# Altium schematic sheet [07] - CPU - CSI, DISP.SchDoc
size A2; DocumentNumber: 7; SheetNumber: 7; SheetTotal: 31
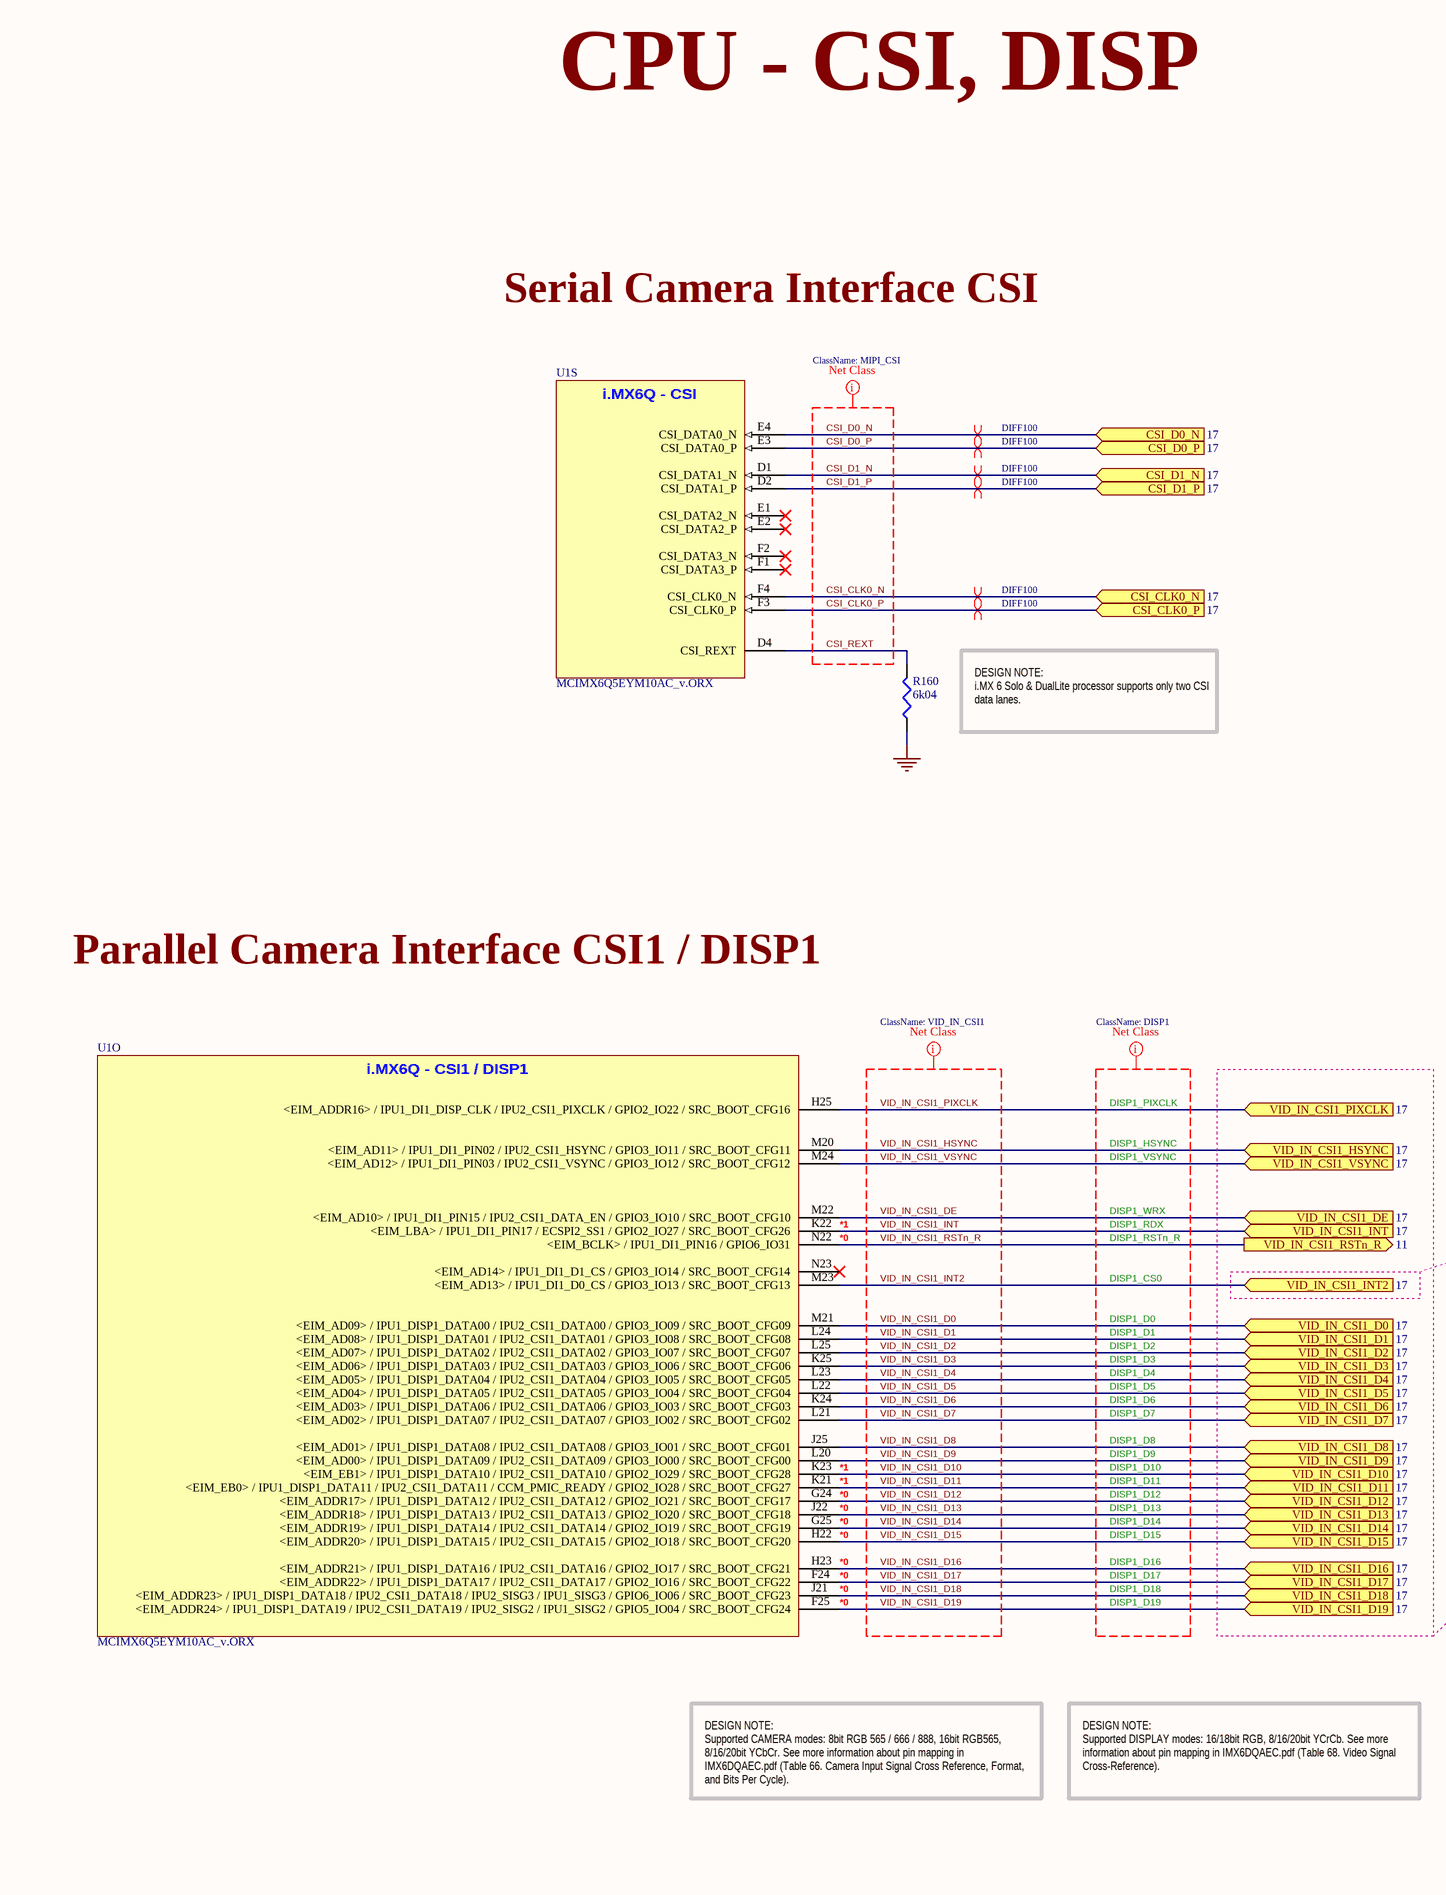
[diagram p0: [07] - CPU - CSI, DISP.SchDoc, left]
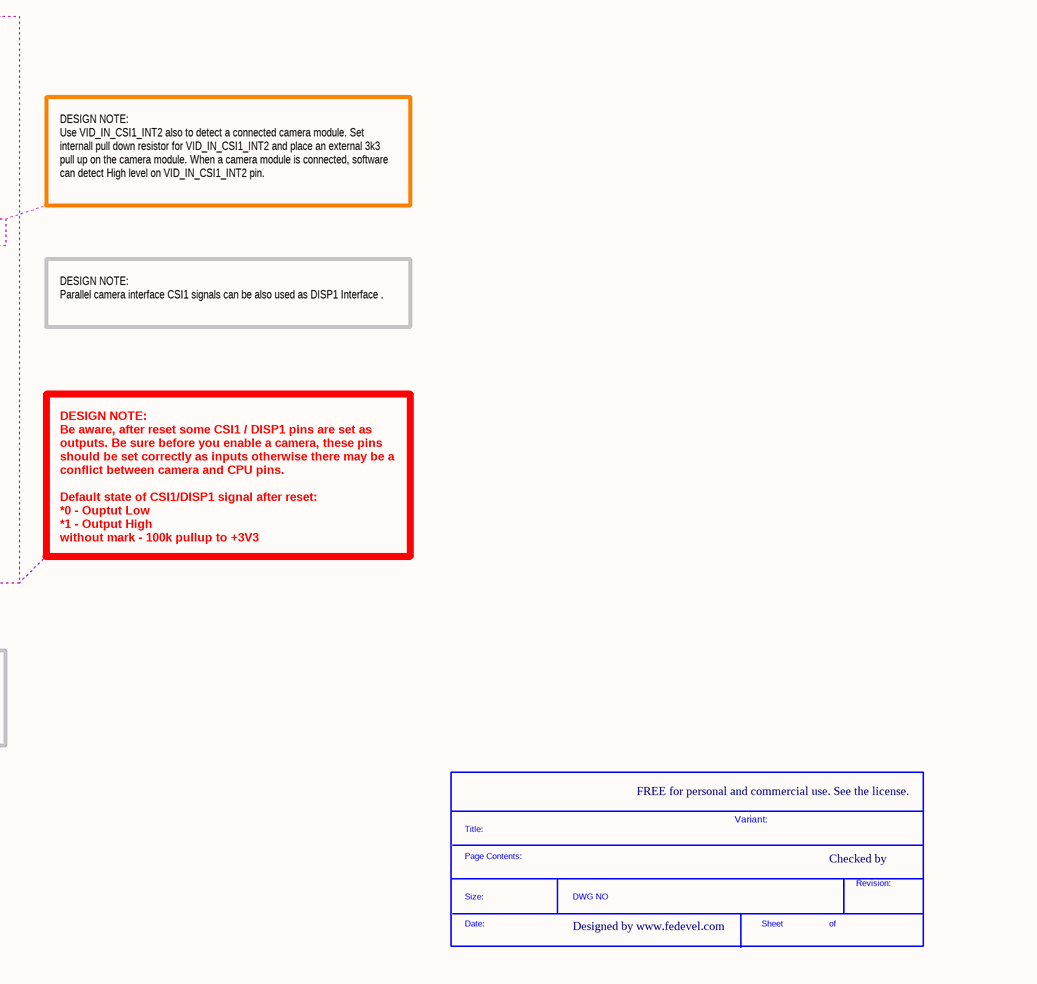
[diagram p1: [07] - CPU - CSI, DISP.SchDoc, right]

## Parts
*  SDTitleBlock  (value not drawn)  (graphical)
R160  6k04  [R0201]
U1  MCIMX6Q5EYM10AC_v.ORX  [PBGA624]  (parts O,S of 21)

## Ports
CSI_CLK0_N (in, see 17), CSI_CLK0_P (in, see 17), CSI_D0_N (in, see 17), CSI_D0_P (in, see 17), CSI_D1_N (in, see 17), CSI_D1_P (in, see 17), VID_IN_CSI1_D0 (in, see 17), VID_IN_CSI1_D1 (in, see 17), VID_IN_CSI1_D2 (in, see 17), VID_IN_CSI1_D3 (in, see 17), VID_IN_CSI1_D4 (in, see 17), VID_IN_CSI1_D5 (in, see 17), VID_IN_CSI1_D6 (in, see 17), VID_IN_CSI1_D7 (in, see 17), VID_IN_CSI1_D8 (in, see 17), VID_IN_CSI1_D9 (in, see 17), VID_IN_CSI1_D10 (in, see 17), VID_IN_CSI1_D11 (in, see 17), VID_IN_CSI1_D12 (in, see 17), VID_IN_CSI1_D13 (in, see 17), VID_IN_CSI1_D14 (in, see 17), VID_IN_CSI1_D15 (in, see 17), VID_IN_CSI1_D16 (in, see 17), VID_IN_CSI1_D17 (in, see 17), VID_IN_CSI1_D18 (in, see 17), VID_IN_CSI1_D19 (in, see 17), VID_IN_CSI1_DE (in, see 17), VID_IN_CSI1_HSYNC (in, see 17), VID_IN_CSI1_INT2 (in, see 17), VID_IN_CSI1_INT (in, see 17), VID_IN_CSI1_PIXCLK (in, see 17), VID_IN_CSI1_RSTn_R (out, see 11), VID_IN_CSI1_VSYNC (in, see 17)

## Nets
GND: R160.1
CSI_CLK0_N: U1.F4(CSI_CLK0_N) ; port CSI_CLK0_N
CSI_CLK0_P: U1.F3(CSI_CLK0_P) ; port CSI_CLK0_P
CSI_D0_N: U1.E4(CSI_DATA0_N) ; port CSI_D0_N
CSI_D0_P: U1.E3(CSI_DATA0_P) ; port CSI_D0_P
CSI_D1_N: U1.D1(CSI_DATA1_N) ; port CSI_D1_N
CSI_D1_P: U1.D2(CSI_DATA1_P) ; port CSI_D1_P
CSI_REXT: R160.2 U1.D4(CSI_REXT)
VID_IN_CSI1_D0: U1.M21(<EIM_AD09>_/_IPU1_DISP1_DATA00_/_IPU2_CSI1_DATA00_/_GPIO3_IO09_/_SRC_BOOT_CFG09) ; port VID_IN_CSI1_D0
VID_IN_CSI1_D1: U1.L24(<EIM_AD08>_/_IPU1_DISP1_DATA01_/_IPU2_CSI1_DATA01_/_GPIO3_IO08_/_SRC_BOOT_CFG08) ; port VID_IN_CSI1_D1
VID_IN_CSI1_D2: U1.L25(<EIM_AD07>_/_IPU1_DISP1_DATA02_/_IPU2_CSI1_DATA02_/_GPIO3_IO07_/_SRC_BOOT_CFG07) ; port VID_IN_CSI1_D2
VID_IN_CSI1_D3: U1.K25(<EIM_AD06>_/_IPU1_DISP1_DATA03_/_IPU2_CSI1_DATA03_/_GPIO3_IO06_/_SRC_BOOT_CFG06) ; port VID_IN_CSI1_D3
VID_IN_CSI1_D4: U1.L23(<EIM_AD05>_/_IPU1_DISP1_DATA04_/_IPU2_CSI1_DATA04_/_GPIO3_IO05_/_SRC_BOOT_CFG05) ; port VID_IN_CSI1_D4
VID_IN_CSI1_D5: U1.L22(<EIM_AD04>_/_IPU1_DISP1_DATA05_/_IPU2_CSI1_DATA05_/_GPIO3_IO04_/_SRC_BOOT_CFG04) ; port VID_IN_CSI1_D5
VID_IN_CSI1_D6: U1.K24(<EIM_AD03>_/_IPU1_DISP1_DATA06_/_IPU2_CSI1_DATA06_/_GPIO3_IO03_/_SRC_BOOT_CFG03) ; port VID_IN_CSI1_D6
VID_IN_CSI1_D7: U1.L21(<EIM_AD02>_/_IPU1_DISP1_DATA07_/_IPU2_CSI1_DATA07_/_GPIO3_IO02_/_SRC_BOOT_CFG02) ; port VID_IN_CSI1_D7
VID_IN_CSI1_D8: U1.J25(<EIM_AD01>_/_IPU1_DISP1_DATA08_/_IPU2_CSI1_DATA08_/_GPIO3_IO01_/_SRC_BOOT_CFG01) ; port VID_IN_CSI1_D8
VID_IN_CSI1_D9: U1.L20(<EIM_AD00>_/_IPU1_DISP1_DATA09_/_IPU2_CSI1_DATA09_/_GPIO3_IO00_/_SRC_BOOT_CFG00) ; port VID_IN_CSI1_D9
VID_IN_CSI1_D10: U1.K23(<EIM_EB1>_/_IPU1_DISP1_DATA10_/_IPU2_CSI1_DATA10_/_GPIO2_IO29_/_SRC_BOOT_CFG28) ; port VID_IN_CSI1_D10
VID_IN_CSI1_D11: U1.K21(<EIM_EB0>_/_IPU1_DISP1_DATA11_/_IPU2_CSI1_DATA11_/_CCM_PMIC_READY_/_GPIO2_IO28_/_SRC_BOOT_CFG27) ; port VID_IN_CSI1_D11
VID_IN_CSI1_D12: U1.G24(<EIM_ADDR17>_/_IPU1_DISP1_DATA12_/_IPU2_CSI1_DATA12_/_GPIO2_IO21_/_SRC_BOOT_CFG17) ; port VID_IN_CSI1_D12
VID_IN_CSI1_D13: U1.J22(<EIM_ADDR18>_/_IPU1_DISP1_DATA13_/_IPU2_CSI1_DATA13_/_GPIO2_IO20_/_SRC_BOOT_CFG18) ; port VID_IN_CSI1_D13
VID_IN_CSI1_D14: U1.G25(<EIM_ADDR19>_/_IPU1_DISP1_DATA14_/_IPU2_CSI1_DATA14_/_GPIO2_IO19_/_SRC_BOOT_CFG19) ; port VID_IN_CSI1_D14
VID_IN_CSI1_D15: U1.H22(<EIM_ADDR20>_/_IPU1_DISP1_DATA15_/_IPU2_CSI1_DATA15_/_GPIO2_IO18_/_SRC_BOOT_CFG20) ; port VID_IN_CSI1_D15
VID_IN_CSI1_D16: U1.H23(<EIM_ADDR21>_/_IPU1_DISP1_DATA16_/_IPU2_CSI1_DATA16_/_GPIO2_IO17_/_SRC_BOOT_CFG21) ; port VID_IN_CSI1_D16
VID_IN_CSI1_D17: U1.F24(<EIM_ADDR22>_/_IPU1_DISP1_DATA17_/_IPU2_CSI1_DATA17_/_GPIO2_IO16_/_SRC_BOOT_CFG22) ; port VID_IN_CSI1_D17
VID_IN_CSI1_D18: U1.J21(<EIM_ADDR23>_/_IPU1_DISP1_DATA18_/_IPU2_CSI1_DATA18_/_IPU2_SISG3_/_IPU1_SISG3_/_GPIO6_IO06_/_SRC_BOOT_CFG23) ; port VID_IN_CSI1_D18
VID_IN_CSI1_D19: U1.F25(<EIM_ADDR24>_/_IPU1_DISP1_DATA19_/_IPU2_CSI1_DATA19_/_IPU2_SISG2_/_IPU1_SISG2_/_GPIO5_IO04_/_SRC_BOOT_CFG24) ; port VID_IN_CSI1_D19
VID_IN_CSI1_DE: U1.M22(<EIM_AD10>_/_IPU1_DI1_PIN15_/_IPU2_CSI1_DATA_EN_/_GPIO3_IO10_/_SRC_BOOT_CFG10) ; port VID_IN_CSI1_DE
VID_IN_CSI1_HSYNC: U1.M20(<EIM_AD11>_/_IPU1_DI1_PIN02_/_IPU2_CSI1_HSYNC_/_GPIO3_IO11_/_SRC_BOOT_CFG11) ; port VID_IN_CSI1_HSYNC
VID_IN_CSI1_INT: U1.K22(<EIM_LBA>_/_IPU1_DI1_PIN17_/_ECSPI2_SS1_/_GPIO2_IO27_/_SRC_BOOT_CFG26) ; port VID_IN_CSI1_INT
VID_IN_CSI1_INT2: U1.M23(<EIM_AD13>_/_IPU1_DI1_D0_CS_/_GPIO3_IO13_/_SRC_BOOT_CFG13) ; port VID_IN_CSI1_INT2
VID_IN_CSI1_PIXCLK: U1.H25(<EIM_ADDR16>_/_IPU1_DI1_DISP_CLK_/_IPU2_CSI1_PIXCLK_/_GPIO2_IO22_/_SRC_BOOT_CFG16) ; port VID_IN_CSI1_PIXCLK
VID_IN_CSI1_RSTn_R: U1.N22(<EIM_BCLK>_/_IPU1_DI1_PIN16_/_GPIO6_IO31) ; port VID_IN_CSI1_RSTn_R
VID_IN_CSI1_VSYNC: U1.M24(<EIM_AD12>_/_IPU1_DI1_PIN03_/_IPU2_CSI1_VSYNC_/_GPIO3_IO12_/_SRC_BOOT_CFG12) ; port VID_IN_CSI1_VSYNC

Not connected (* = marked no-connect by the designer): U1 E1(CSI_DATA2_N)* E2(CSI_DATA2_P)* F1(CSI_DATA3_P)* F2(CSI_DATA3_N)* N23(<EIM_AD14>_/_IPU1_DI1_D1_CS_/_GPIO3_IO14_/_SRC_BOOT_CFG14)*

## Layout directives
net class DISP1: (no net found under the mark)
net class VID_IN_CSI1: VID_IN_CSI1_D0, VID_IN_CSI1_D1, VID_IN_CSI1_D2, VID_IN_CSI1_D3, VID_IN_CSI1_D4, VID_IN_CSI1_D5, VID_IN_CSI1_D6, VID_IN_CSI1_D7, VID_IN_CSI1_D8, VID_IN_CSI1_D9, VID_IN_CSI1_D10, VID_IN_CSI1_D11, VID_IN_CSI1_D12, VID_IN_CSI1_D13, VID_IN_CSI1_D14, VID_IN_CSI1_D15, VID_IN_CSI1_D16, VID_IN_CSI1_D17, VID_IN_CSI1_D18, VID_IN_CSI1_D19, VID_IN_CSI1_DE, VID_IN_CSI1_HSYNC, VID_IN_CSI1_INT, VID_IN_CSI1_INT2, VID_IN_CSI1_PIXCLK, VID_IN_CSI1_RSTn_R, VID_IN_CSI1_VSYNC
differential pair; net class DIFF100: CSI_CLK0_N, CSI_CLK0_P, CSI_D0_N, CSI_D0_P, CSI_D1_N, CSI_D1_P
net class MIPI_CSI: CSI_CLK0_N, CSI_CLK0_P, CSI_D0_N, CSI_D0_P, CSI_D1_N, CSI_D1_P, CSI_REXT

## Notes on the sheet
- CPU - CSI, DISP
- Serial Camera Interface CSI
- DESIGN NOTE:
  i.MX 6 Solo & DualLite processor supports only two CSI data lanes.
- Parallel Camera Interface CSI1 / DISP1
- DISP1_PIXCLK
- DISP1_HSYNC
- DISP1_VSYNC
- (near U1) *1
- (near U1) *0
- DISP1_RDX
- DISP1_WRX
- DISP1_RSTn_R
- DESIGN NOTE:
  Use VID_IN_CSI1_INT2 also to detect a connected camera module. Set internall pull down resistor for VID_IN_CSI1_INT2 and place an external 3k3 pull up on the camera module. When a camera module is connected, software can detect High level on VID_IN_CSI1_INT2 pin.
- DISP1_D0
- DISP1_CS0
- DISP1_D1
- DISP1_D2
- DISP1_D3
- DISP1_D4
- DISP1_D5
- DESIGN NOTE:
  Parallel camera interface CSI1 signals can be also used as DISP1 Interface .
- DISP1_D6
- DISP1_D7
- DISP1_D8
- DISP1_D9
- DISP1_D10
- DISP1_D11
- DISP1_D12
- DISP1_D13
- DISP1_D14
- DISP1_D15
- DISP1_D16
- DISP1_D17
- DISP1_D18
- DISP1_D19
- DESIGN NOTE:
  Be aware, after reset some CSI1 / DISP1 pins are set as outputs. Be sure before you enable a camera, these pins should be set correctly as inputs otherwise there may be a conflict between camera and CPU pins.
  Default state of CSI1/DISP1 signal after reset:
  *0 - Ouptut Low
  *1 - Output High
  without mark - 100k pullup to +3V3
- DESIGN NOTE:
  Supported CAMERA modes: 8bit RGB 565 / 666 / 888, 16bit RGB565, 8/16/20bit YCbCr. See more information about pin mapping in IMX6DQAEC.pdf (Table 66. Camera Input Signal Cross Reference, Format, and Bits Per Cycle).
- DESIGN NOTE:
  Supported DISPLAY modes: 16/18bit RGB, 8/16/20bit YCrCb. See more information about pin mapping in IMX6DQAEC.pdf (Table 68. Video Signal Cross-Reference).
- FREE for personal and commercial use. See the license.
- Variant:
- Checked by
- Designed by www.fedevel.com
- (in symbol MCIMX6Q5EYM10AC_v.ORX, part O) i.MX6Q - CSI1 / DISP1
- (in symbol MCIMX6Q5EYM10AC_v.ORX, part S) i.MX6Q - CSI
- (in symbol SDTitleBlock) Title:; Page Contents:; Revision:; Size:; DWG NO; Date:; Sheet; of

## Library data of the parts
R160 = ERJ-1GEF6041C: RES 6.04K OHM 1/20W 1% 0201 SMD; Manufacturer: Panasonic Electronic Components; Power (Watts): 0.05W, 1/20W; Temperature Coefficient: ±200ppm/°C; .Creator: MM; Supplier 1: Digi-Key; Manufacturer Part Number: ERJ-1GEF6041C; RoHS: RoHS Compliant; Category: Resistors; Stock 1: 78155; Pricing 1: 1=0.11, 50=0.0414, 100=0.0315, 250=0.0234, 500=0.01728, 1000=0.01152, 5000=0.0081 (USD); Packaging: Cut Tape (CT); Resistance (Ohms): 6.04k; Tolerance: ±1%; Composition: Thick Film; Features: -; Package / Case: 0201 (0603 Metric); Supplier Device Package: 0201; Size / Dimension: 0.024" L x 0.012" W (0.60mm x 0.30mm); Height: 0.010" (0.26mm); Number of Terminations: 2; ComponentLink1URL: http://media.digikey.com/pdf/Data%20Sheets/Panasonic%20Resistors%20Thermistors%20PDFs/ERJ_G,R,E_Rev08.pdf; ComponentLink1Description: http://media.digikey.com/pdf/Data%20Sheets/Panasonic%20Resistors%20Thermistors%20PDFs/ERJ_G,R,E_Rev08.pdf; Supplier Part Number 1: P6.04KABCT-ND; .Checked PCB: MM; .Checked SCH: MM
U1 = MCIMX6Q5EYM10AC_v.ORX: IC MCU 32BIT ARM QUAD 624FCBGA; Manufacturer: Freescale Semiconductor; Core Processor: ARM® Cortex™-A9; Core Size: 32-Bit Quad-Core; Speed: 1.0GHz; Connectivity: CAN, EBI/EMI, ESAI, Ethernet, GPMI, I2C, MMC/SD, PCI, SATA, SPI, UART, USB, USB OTG; Peripherals: DMA, HDMI, I2S/SSI/AC97, MIPI CSI, MIMI DSI, MIPI HIS, PWM, WDT; Number of I /O: 224; Program Memory Type: External Program Memory; RAM Size: 256K x 8; Voltage - Supply (Vcc/Vdd): 0.925 V ~ 1.5 V; Oscillator Type: Internal; .Creator: MM; .Checked PCB: MM, checked by RF; Supplier 1: Digi-Key; Manufacturer Part Number: MCIMX6Q5EYM10AC; RoHS: RoHS Compliant; Category: Integrated Circuits (ICs); Stock 1: 0; Pricing 1: 1=54.98, 10=51.922, 25=48.868, 100=30.5424 (USD); Program Memory Size: -; EEPROM Size: -; Data Converters: -; Operating Temperature: -20°C ~ 105°C; Package / Case: 624-FBGA, FCBGA; Packaging: Tray; ComponentLink1URL: http://cache.freescale.com/files/32bit/doc/data_sheet/IMX6DQCEC.pdf; ComponentLink1Description: http://cache.freescale.com/files/32bit/doc/data_sheet/IMX6DQCEC.pdf; Supplier Part Number 1: MCIMX6Q5EYM10AC-ND